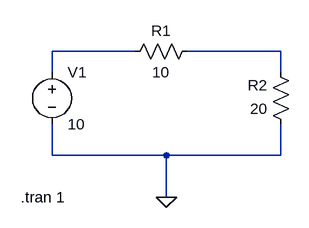
[diagram p0: schematic Draft3.asc]
Draft3.asc, the LTspice schematic file:
Version 4
SHEET 1 880 680
WIRE 96 64 -32 64
WIRE 320 64 176 64
WIRE -32 96 -32 64
WIRE 320 96 320 64
WIRE -32 224 -32 176
WIRE 144 224 -32 224
WIRE 320 224 320 176
WIRE 320 224 144 224
WIRE 144 288 144 224
FLAG 144 288 0
SYMBOL voltage -32 80 R0
SYMATTR InstName V1
SYMATTR Value 10
SYMBOL res 192 48 R90
WINDOW 0 0 56 VBottom 2
WINDOW 3 32 56 VTop 2
SYMATTR InstName R1
SYMATTR Value 10
SYMBOL res 336 192 R180
WINDOW 0 36 76 Left 2
WINDOW 3 36 40 Left 2
SYMATTR InstName R2
SYMATTR Value 20
TEXT -80 288 Left 2 !.tran 1

The netlist it stands for:
* Draft3.asc
V1 N001 0 10
R1 N002 N001 10
R2 0 N002 20
.tran 1
.backanno
.end